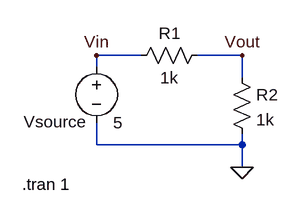
[diagram p0: schematic Voltage_Divider.asc]
Voltage_Divider.asc, the LTspice schematic file:
Version 4
SHEET 1 880 680
WIRE 112 144 48 144
WIRE 256 144 192 144
WIRE 48 160 48 144
WIRE 256 176 256 144
WIRE 48 272 48 240
WIRE 256 272 256 256
WIRE 256 272 48 272
WIRE 256 304 256 272
FLAG 256 304 0
FLAG 256 144 Vout
FLAG 48 144 Vin
SYMBOL res 208 128 R90
WINDOW 0 0 56 VBottom 2
WINDOW 3 32 56 VTop 2
SYMATTR InstName R1
SYMATTR Value 1k
SYMBOL res 240 160 R0
SYMATTR InstName R2
SYMATTR Value 1k
SYMBOL voltage 48 144 R0
WINDOW 0 -104 95 Left 2
WINDOW 123 0 0 Left 0
WINDOW 39 0 0 Left 0
SYMATTR InstName Vsource
SYMATTR Value 5
TEXT -58 328 Left 2 !.tran 1

The netlist it stands for:
* Voltage_Divider.asc
R1 Vout Vin 1k
R2 Vout 0 1k
Vsource Vin 0 5
.tran 1
.backanno
.end